# EAGLE schematic ROBOT_PI v4 (EAGLE 9.7.0)

## Sheet 1 of 2
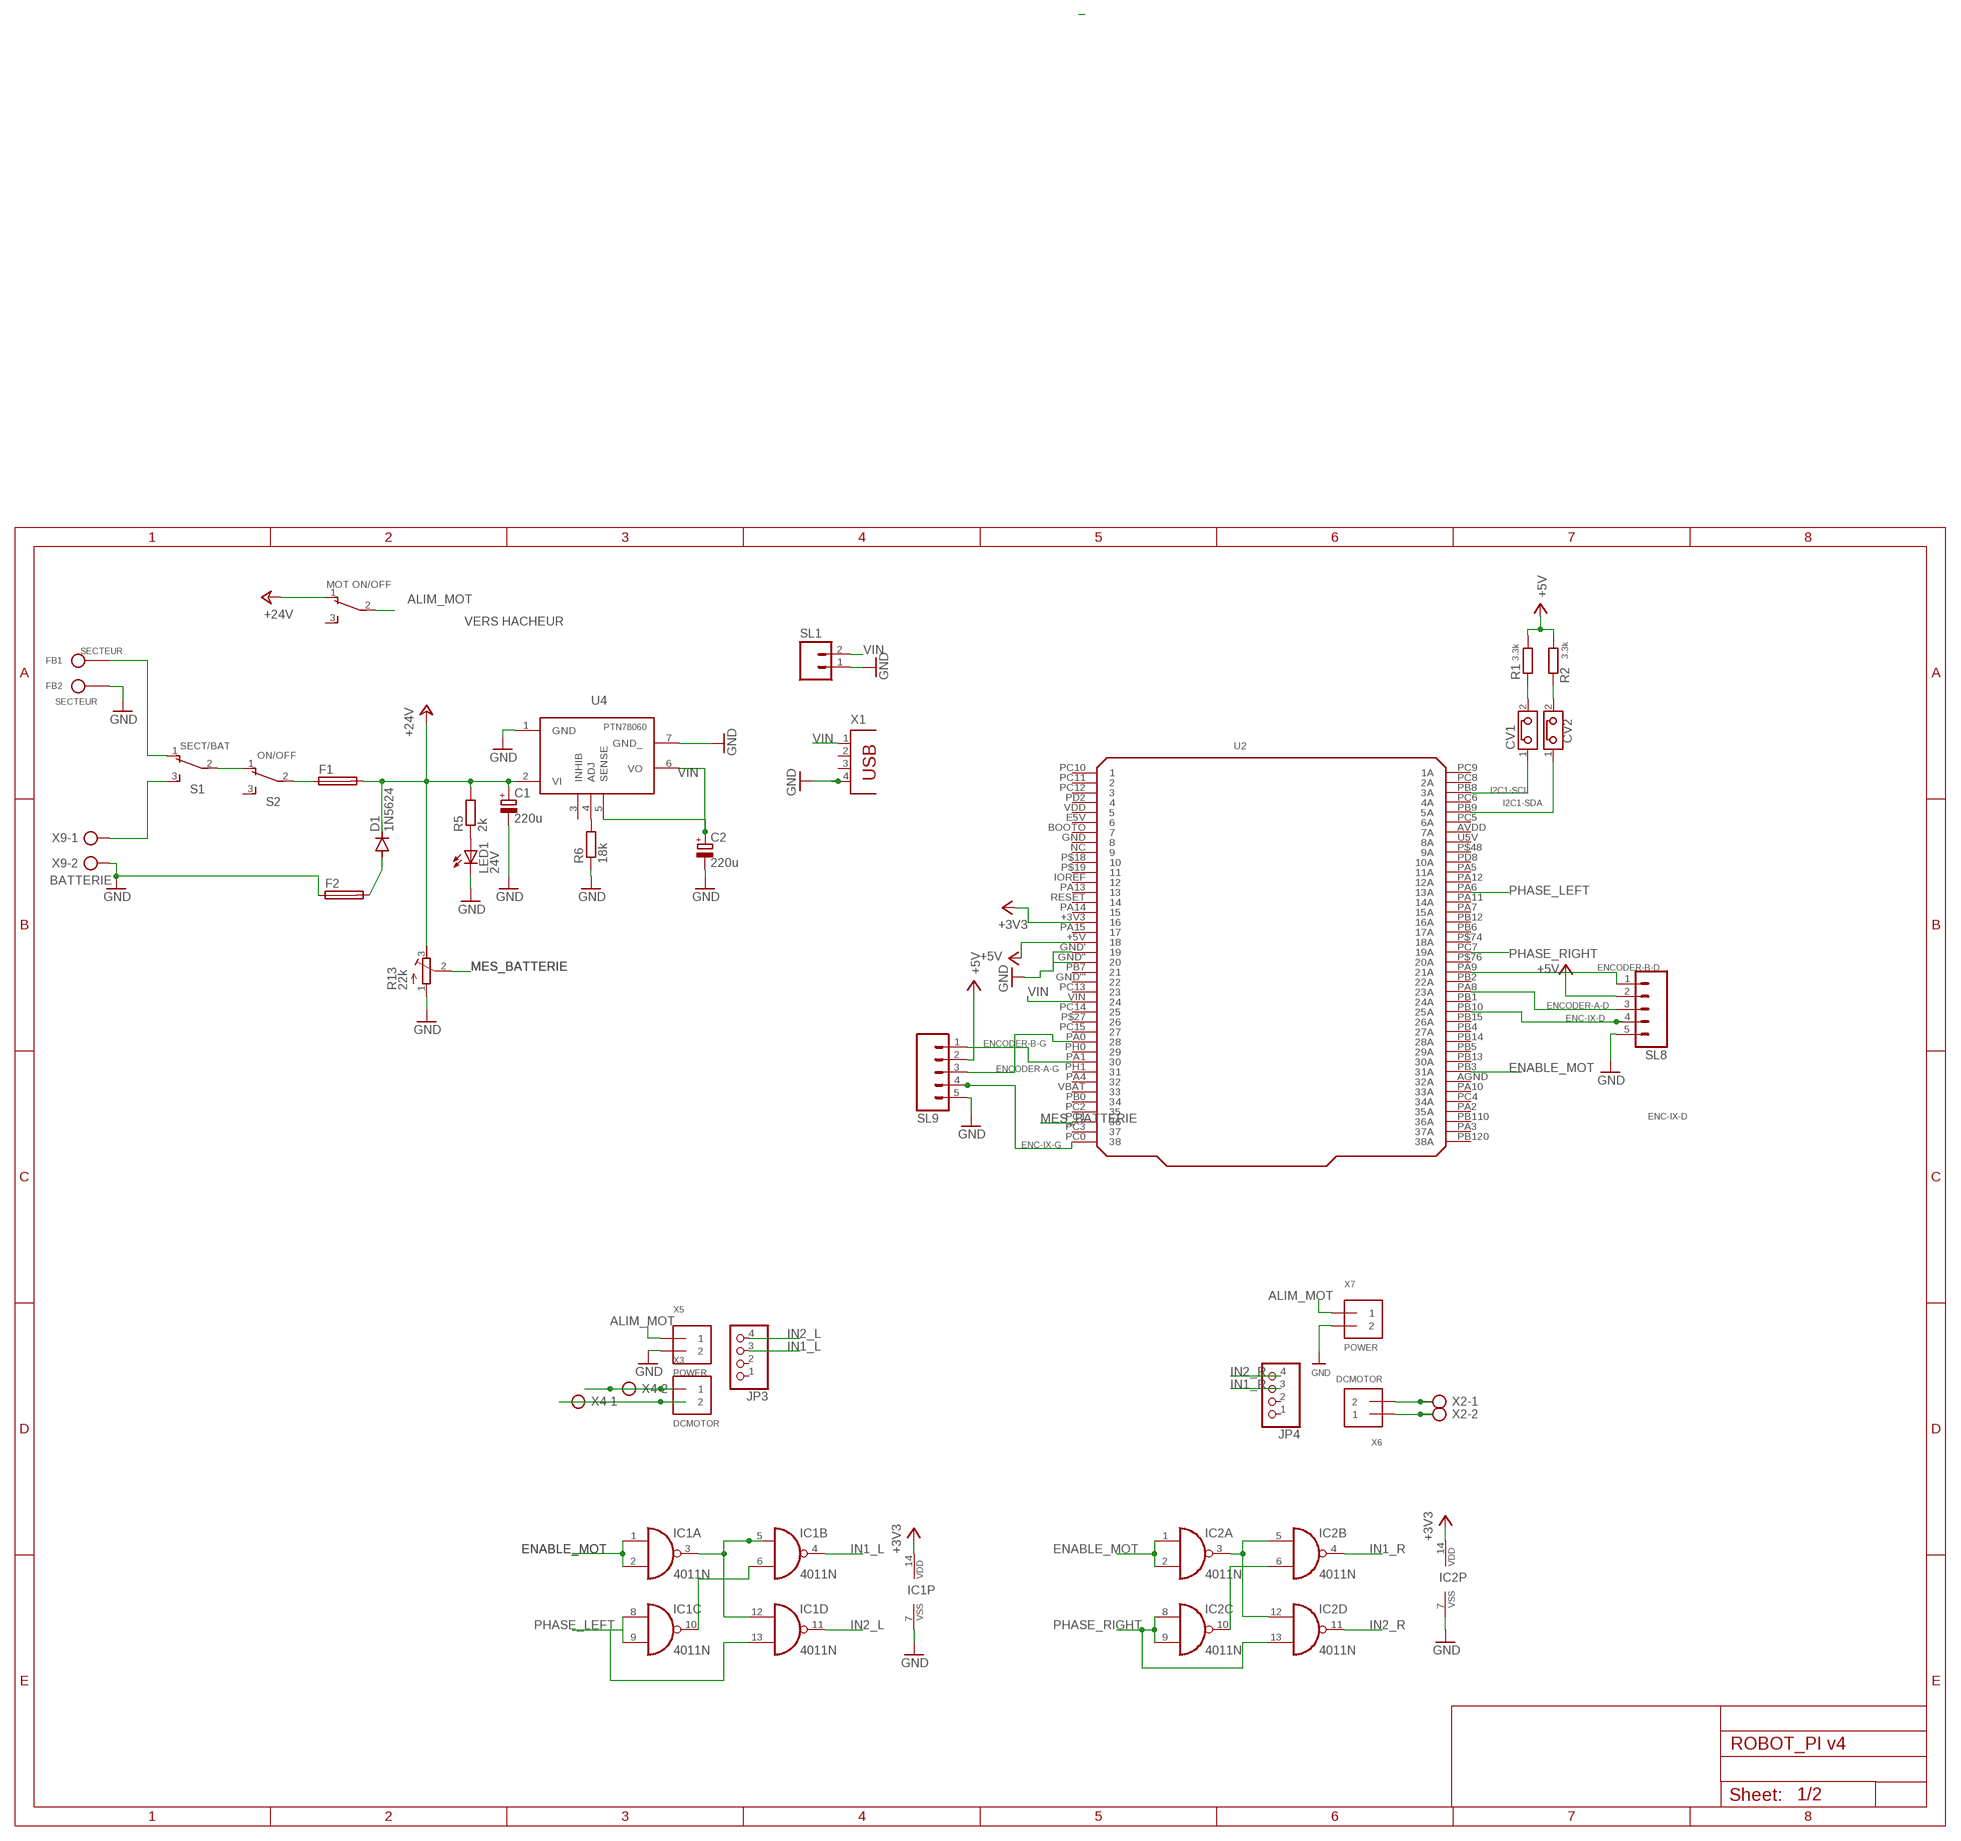
[diagram p0: schematic, sheet 1]

### Parts
C1  220u  CPOL-EUE5-10.5  [E5-10,5]
C2  220u  CPOL-EUE5-10.5  [E5-10,5]
CV1  CAVALIER  [CAVALIER]
CV2  CAVALIER  [CAVALIER]
D1  1N5624  [DO201-15]
F1  SH22,5  [SH22,5]
F2  SH22,5  [SH22,5]
FB1  SECTEUR  F_BANANE  [F_BANANE]
FB2  SECTEUR  F_BANANE  [F_BANANE]
IC1  4011N  [DIL14]
IC2  4011N  [DIL14]
JP3  HEADER-1X476MIL  [1X04_ROUND_76]
JP4  HEADER-1X476MIL  [1X04_ROUND_76]
LED1  24V  LED5MM  [LED5MM]
R1  3.3k  R-EU_0207/10  [0207/10]
R2  3.3k  R-EU_0207/10  [0207/10]
R5  2k  R-EU_0207/10  [0207/10]
R6  18k  R-EU_0207/10  [0207/10]
R13  22k  R-TRIMM3296W  [RTRIM3296W]
S1  SECT/BAT  TL36PO  [TL3XPO]
S2  ON/OFF  TL36PO  [TL3XPO]
S3  MOT ON/OFF  TL36PO  [TL3XPO]
SL1  M02  [02P]
SL8  M05  [05P]
SL9  M05  [05P]
U2  NUCLEO  [P_NUCLEO]
U4  PTN78060WAD  [PTN78060]
X1  PN87520  [PN87520]
X2  AK300/2  [AK300/2]
X3  DCMOTOR  TERMBLOCK_1X2  [TERMBLOCK_1X2-3.5MM]
X4  AK300/2  [AK300/2]
X5  POWER  TERMBLOCK_1X2  [TERMBLOCK_1X2-3.5MM]
X6  DCMOTOR  TERMBLOCK_1X2  [TERMBLOCK_1X2-3.5MM]
X7  POWER  TERMBLOCK_1X2  [TERMBLOCK_1X2-3.5MM]
X9  BATTERIE  AK300/2  [AK300/2]

### Nets
+3V3: IC1.14(P:VDD) IC2.14(P:VDD) U2.+3V3
+5V: R1.2 R2.1 SL8.2 SL9.2 U2.+5V
+24V: C1.+ D1.C F1.2 R5.2 R13.3(E) S3.1(O) U4.2(VI)
ALIM_MOT: S3.2(P) X5.1 X7.1
ENABLE_MOT: IC1.1(A:I0) IC1.2(A:I1) IC2.1(A:I0) IC2.2(A:I1) U2.PB3(31A)
ENC-IX-D: SL8.4 U2.PB10(25A)
GND: C1.- C2.- F2.1 FB2.P$1 IC1.7(P:VSS) IC2.7(P:VSS) LED1.K(C) R6.1 R13.1(A) SL1.1 SL8.5 SL9.5 U2.GND' U2.GND'' U4.1(GND) U4.7(GND_) X1.4 X5.2 X7.2 X9.2
IN1_L: IC1.4(B:O) JP3.3
IN1_R: IC2.4(B:O) JP4.3
IN2_L: IC1.11(D:O) JP3.4
IN2_R: IC2.11(D:O) JP4.4
MES_BATTERIE: R13.2(S) U2.PC1
N$1: X3.1 X4.2
N$4: X3.2 X4.1
N$5: X2.1 X6.2
N$6: X2.2 X6.1
N$8: F1.1 S2.2(P)
N$10: IC1.6(B:I1) IC1.10(C:O)
N$11: CV1.1 U2.PB8(3A)
N$12: CV2.1 U2.PB9(5A)
N$13: D1.A F2.2
N$14: IC1.3(A:O) IC1.5(B:I0) IC1.12(D:I0)
N$22: IC2.3(A:O) IC2.5(B:I0) IC2.12(D:I0)
N$34: IC2.6(B:I1) IC2.10(C:O)
N$37: SL8.1 U2.PA9(21A)
N$39: SL8.3 U2.PA8(23A)
N$44: SL9.1 U2.PA1
N$47: SL9.3 U2.PA0
N$48: SL9.4 U2.PC0
N$56: CV1.2 R1.1
N$57: CV2.2 R2.2
N$71: LED1.A R5.1
N$74: S1.2(P) S2.1(O)
N$78: S1.3(S) X9.1
N$79: FB1.P$1 S1.1(O)
N$107: R6.2 U4.4(ADJ)
PHASE_LEFT: IC1.8(C:I0) IC1.9(C:I1) IC1.13(D:I1) U2.PA6(13A)
PHASE_RIGHT: IC2.8(C:I0) IC2.9(C:I1) IC2.13(D:I1) U2.PC7(19A)
VIN: C2.+ SL1.2 U2.VIN U4.5(SENSE) U4.6(VO) X1.1
Unconnected: JP3.1 JP3.2 JP4.1 JP4.2 S2.3(S) S3.3(S) U2.AVDD(7A) U2.BOOTO U2.IOREF U2.NC U2.P$18 U2.P$19 U2.P$27 U2.P$74(18A) U2.PA2(35A) U2.PA3(37A) U2.PA4 U2.PA5(11A) U2.PA7(15A) U2.PA10(33A) U2.PA11(14A) U2.PA12(12A) U2.PA13 U2.PA14 U2.PA15 U2.PB0 U2.PB1(24A) U2.PB2(22A) U2.PB4(27A) U2.PB5(29A) U2.PB6(17A) U2.PB7 U2.PB12(16A) U2.PB13(30A) U2.PB14(28A) U2.PB15(26A) U2.PB110(36A) U2.PB120(38A) U2.PC2 U2.PC3 U2.PC4(34A) U2.PC5(6A) U2.PC6(4A) U2.PC8(2A) U2.PC9(1A) U2.PC10 U2.PC11 U2.PC12 U2.PC13 U2.PC14 U2.PC15 U2.PD2 U2.PD8(10A) U2.PH0 U2.PH1 U2.RESET U2.U5V(8A) U2.VBAT U2.VDD U4.3(INHIB) X1.2 X1.3

### Notes on the sheet
- VERS HACHEUR
- I2C1-SCL
- I2C1-SDA
- ENCODER-B-D
- ENCODER-A-D
- ENC-IX-D
- ENCODER-B-G
- ENCODER-A-G
- ENC-IX-D
- ENC-IX-G

## Sheet 2 of 2
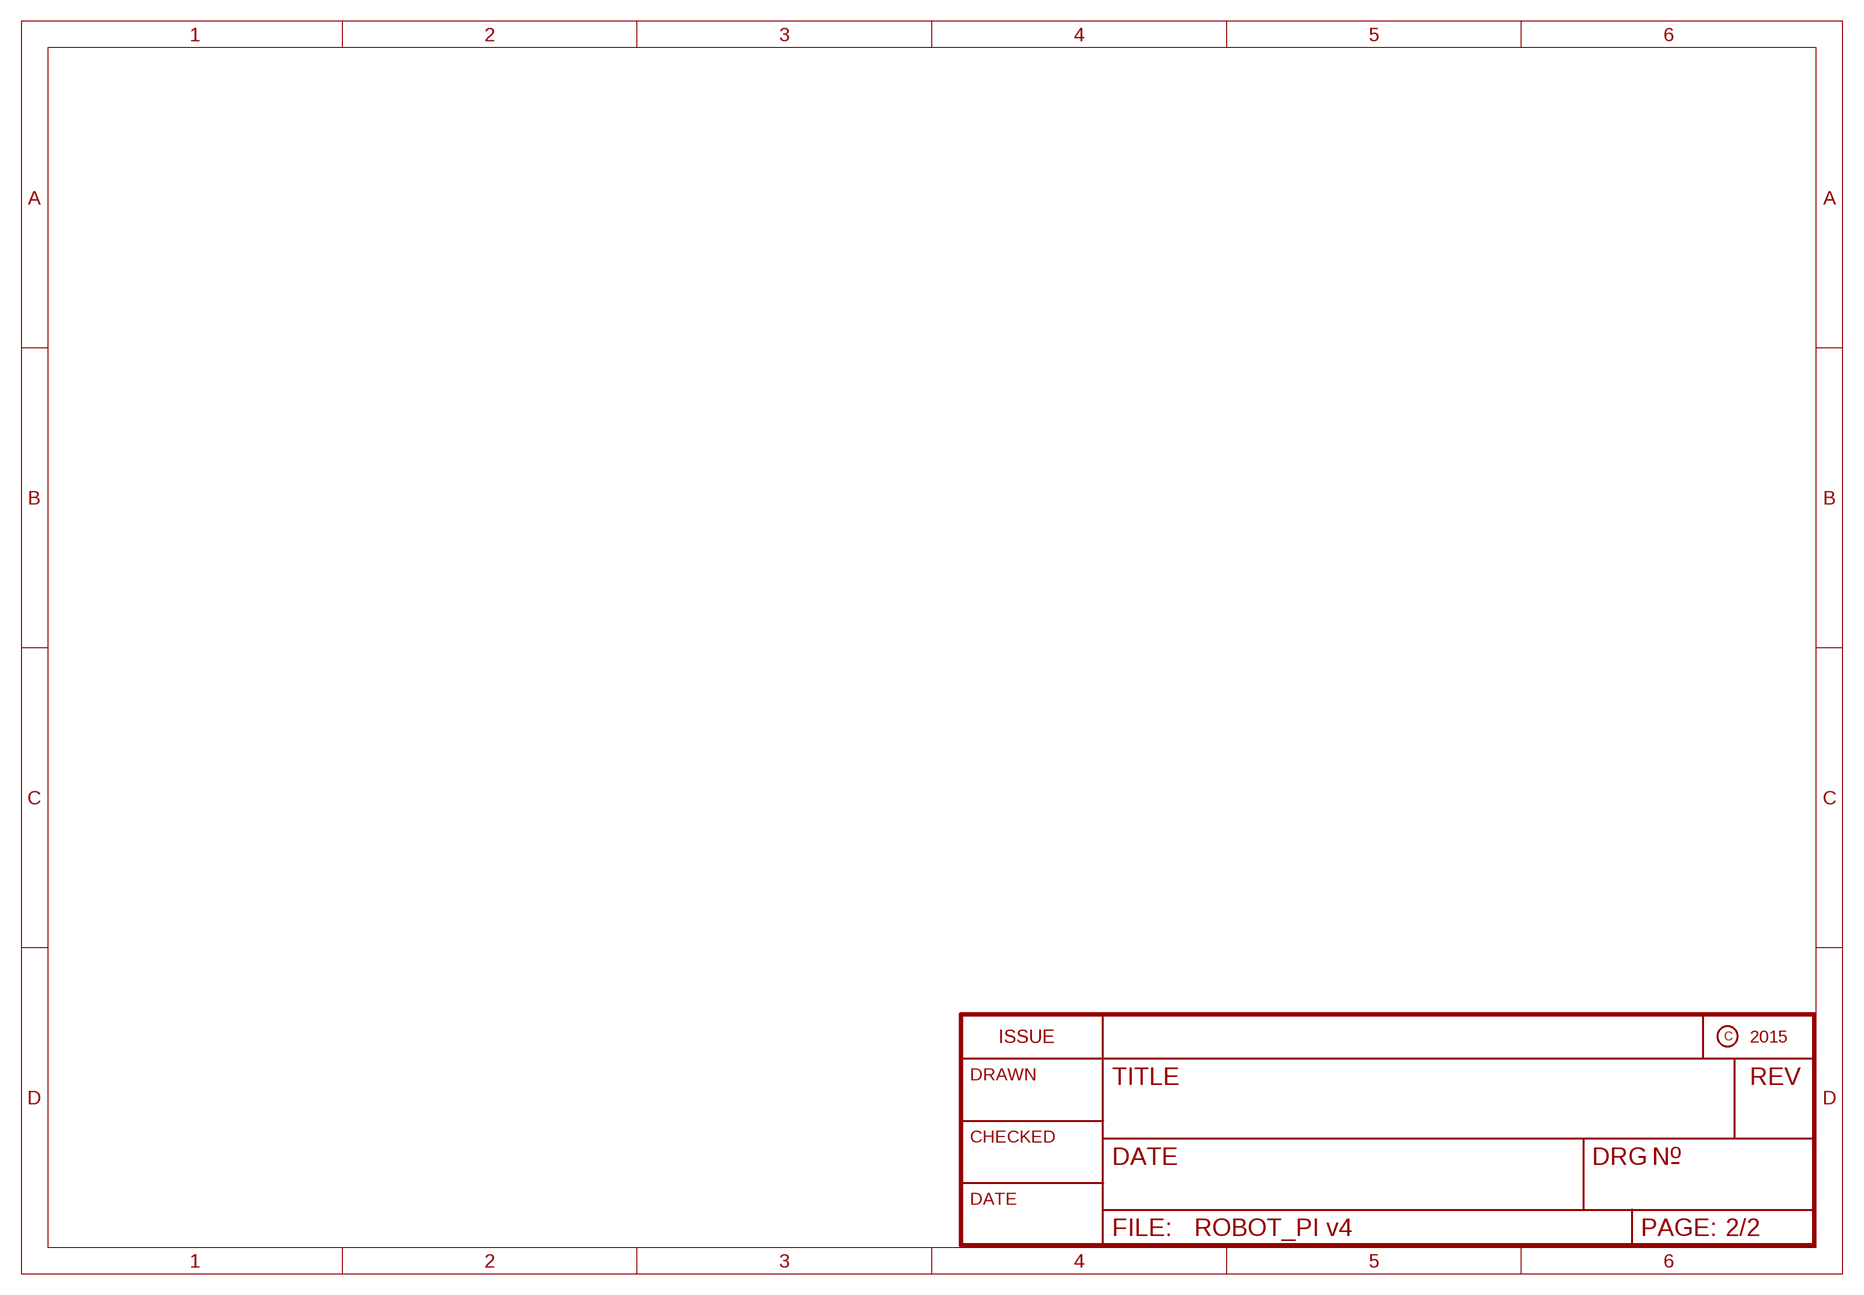
[diagram p1: schematic, sheet 2]

## Power pins joined to a net without a drawn wire
6: U2.E5V
8: U2.GND
9A: U2.P$48(9A)
20A: U2.P$76(20A)
22: U2.GND'''
32A: U2.AGND(32A)

## Library data of the parts
C1 C2 = rcl:CPOL-EU: POLARIZED CAPACITOR, European symbol
CV1 CV2 = JL_Composants:CAVALIER: Cavalier_2
D1 = diode:1N5624: DIODE controlled avalanche rectifier
F1 F2 = fuse:SH22,5: FUSE HOLDER grid 22,5 mm, OGN0031 8201, Schurter (Buerklin); MF: SCHURTER; MPN: 0031.8201; OC_FARNELL: 1162740; OC_NEWARK: 96F8317
FB1 FB2 = JL_Composants:F_BANANE
IC1 IC2 = 40xx:4011: Quad 2-input NAND
JP3 JP4 = microbuilder:HEADER-1X4: PIN HEADER
LED1 = led:LED: LED OSRAM: - CHIPLED LG R971, LG N971, LY N971, LG Q971, LY Q971, LO R971, LY R971 LH N974, LH R974 LS Q976, LO Q976, LY Q976 LO Q996 - Hyper CHIPLED LW Q18S LB Q993, LB Q99A, LB R99A - SideLED LS A670, LO A670, LY A670, LG A670, LP A670 LB A673, LV A673, LT A673, LW A673 LH A674 LY A675 LS A676, LA A676, LO A676, LY A676, LW A676 LS A679, LY A679, LG A679 - Hyper Micro SIDELED® LS Y876, LA Y876, LO Y876, LY Y876 LT Y87S - SmartLED LW L88C, LW L88S LB L89C, LB L89S, LG L890 LS L89K, LO L89K, LY L89K LS L896, LA L896, LO L896, LY L896 - TOPLED LS T670, LO T670, LY T670, LG T670, LP T670 LSG T670, LSP T670, LSY T670, LOP T670, LYG T670 LG T671, LOG T671, LSG T671 LB T673, LV T673, LT T673, LW T673 LH T674 LS T676, LA T676, LO T676, LY T676, LB T676, LH T676, LSB T676, LW T676 LB T67C, LV T67C, LT T67C, LS T67K, LO T67K, LY T67K, LW E67C LS E67B, LA E67B, LO E67B, LY E67B, LB E67C, LV E67C, LT E67C LW T67C LS T679, LY T679, LG T679 LS T770, LO T770, LY T770, LG T770, LP T770 LB T773, LV T773, LT T773, LW T773 LH T774 LS E675, LA E675, LY E675, LS T675 LS T776, LA T776, LO T776, LY T776, LB T776 LHGB T686 LT T68C, LB T68C - Hyper Mini TOPLED® LB M676 - Mini TOPLED Santana® LG M470 LS M47K, LO M47K, LY M47K Source: http://www.osram.convergy.de LUXEON: - LUMILED® LXK2-PW12-R00, LXK2-PW12-S00, LXK2-PW14-U00, LXK2-PW14-V00 LXK2-PM12-R00, LXK2-PM12-S00, LXK2-PM14-U00 LXK2-PE12-Q00, LXK2-PE12-R00, LXK2-PE12-S00, LXK2-PE14-T00, LXK2-PE14-U00 LXK2-PB12-K00, LXK2-PB12-L00, LXK2-PB12-M00, LXK2-PB14-N00, LXK2-PB14-P00, LXK2-PB14-Q00 LXK2-PR12-L00, LXK2-PR12-M00, LXK2-PR14-Q00, LXK2-PR14-R00 LXK2-PD12-Q00, LXK2-PD12-R00, LXK2-PD12-S00 LXK2-PH12-R00, LXK2-PH12-S00 LXK2-PL12-P00, LXK2-PL12-Q00, LXK2-PL12-R00 Source: www.luxeon.com KINGBRIGHT: KA-3528ASYC Source: www.kingbright.com
R1 R2 R5 R6 = rcl:R-EU_: RESISTOR, European symbol
R13 = rcl:R-TRIMM: Trimm resistor
S1-S3 = switch:TL36PO: TINY SWITCH ON - ON Source: http://www2.produktinfo.conrad.com/datenblaetter/700000-724999/705152-da-01-de-Subminiaturschalter_TL_36YO.pdf
SL1 = con-amp-quick:M02: AMP QUICK CONNECTOR; OC_FARNELL: unknown; OC_NEWARK: unknown
SL8 SL9 = con-amp-quick:M05: AMP QUICK CONNECTOR; OC_FARNELL: unknown; OC_NEWARK: unknown
U2 = JL_Composants:NUCLEO
U4 = JL_Composants:PTN78060WAD: DC-DC NON ISOLATED
X1 = con-berg:PN87520: BERG USB connector; OC_FARNELL: unknown; OC_NEWARK: unknown
X2 X4 X9 = con-ptr500:AK300/2: CONNECTOR; OC_FARNELL: unknown; OC_NEWARK: unknown
X3 X5-X7 = microbuilder:TERMBLOCK_1X2: 3.5mm Terminal block http://www.ladyada.net/library/pcb/eaglelibrary.html